# Altium schematic sheet Project_Overview.SchDoc: Project Overview
size A4; Date: Not used; ApprovedBy: Not used; CheckedBy: Not used; Author: Not used; CompanyName: STMicroelectronics; DrawnBy: Not used; Engineer: Not used; Organization: Not used; Address1: Not used; Address2: Not used; Address3: Not used; Address4: Not used; DocumentNumber: Not used; Revision: Not used; SheetNumber: 1; SheetTotal: 6; CurrentTime: Not used; CurrentDate: Not used; Time: Not used; DocumentFullPathAndName: Not used; DocumentName: Not used; ModifiedDate: Not used; ImagePath: Not used; ProjectName: Not used; Application_BuildNumber: Not used
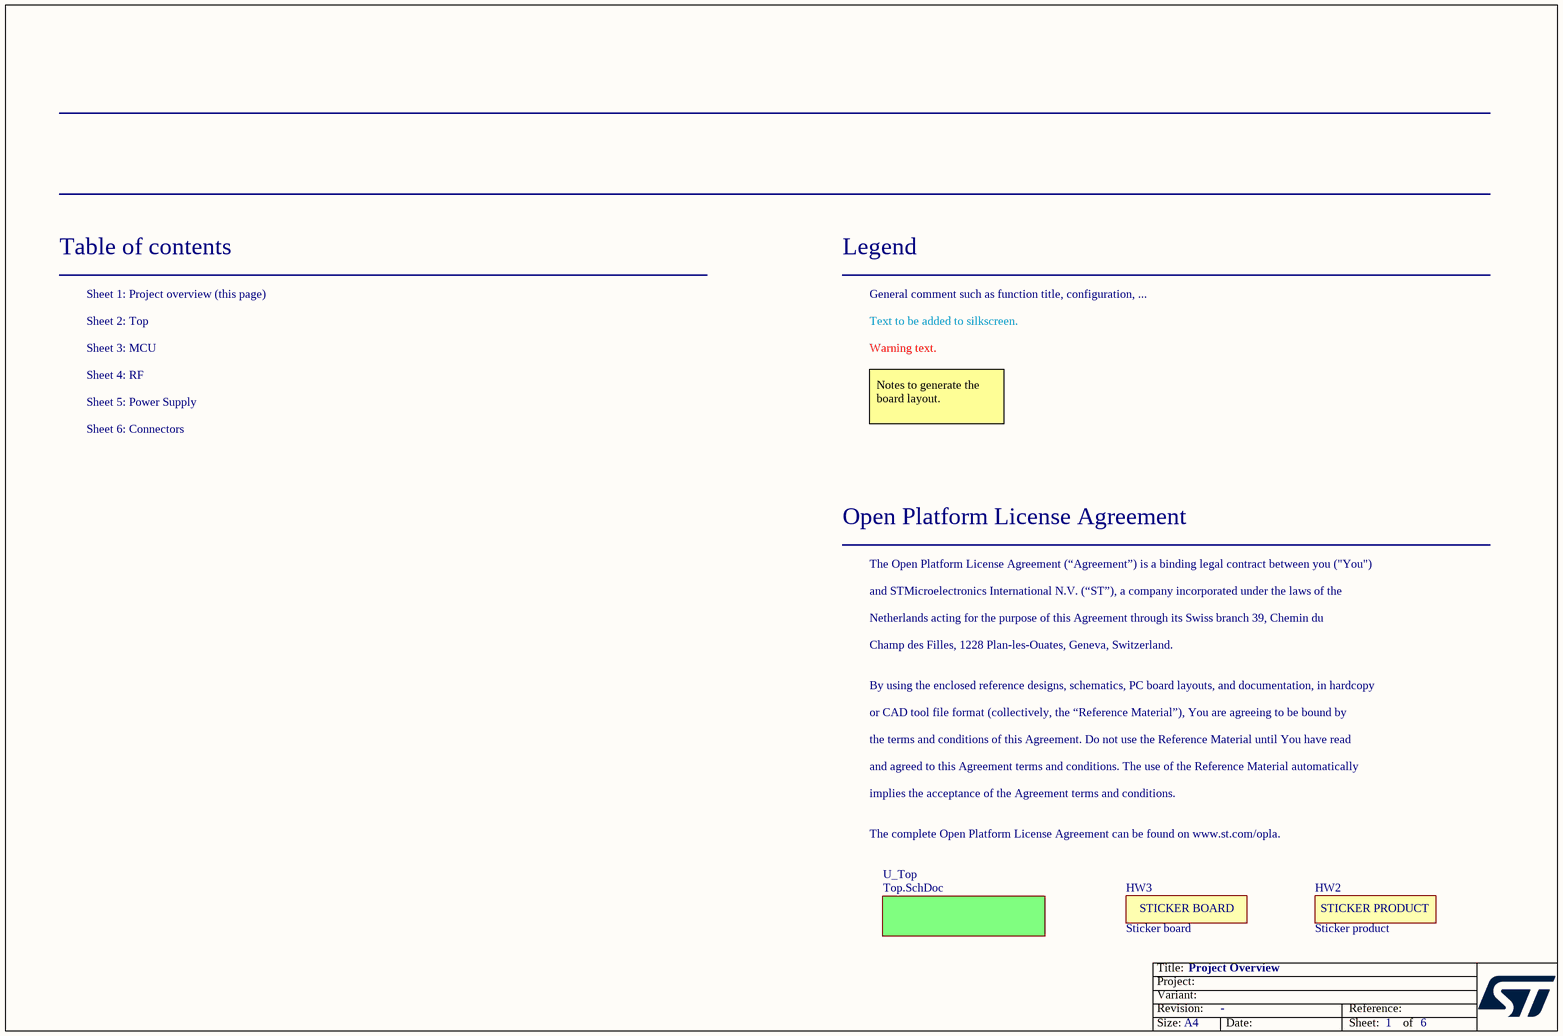
[diagram p0: Project_Overview.SchDoc]

## Parts
HW2  value Sticker product  [STICKER_PRODUCT_25X5]  (hidden comment: STICKER_PRODUCT)  (no BOM)
HW3  value Sticker board  [STICKER_BOARD_25X5]  (hidden comment: STICKER_BOARD)  (no BOM)

## Sub-sheets
U_Top = Top.SchDoc: no entries

## Notes on the sheet
- Table of contents
- Sheet 1: Project overview (this page)
- Legend
- General comment such as function title, configuration, ...
- Sheet 2: Top
- Sheet 3: MCU
- Sheet 4: RF
- Text to be added to silkscreen.
- Warning text.
- Sheet 5: Power Supply
- Sheet 6: Connectors
- Notes to generate the board layout.
- Open Platform License Agreement
- The Open Platform License Agreement (“Agreement”) is a binding legal contract between you ("You")
- and STMicroelectronics International N.V. (“ST”), a company incorporated under the laws of the
- Netherlands acting for the purpose of this Agreement through its Swiss branch 39, Chemin du
- Champ des Filles, 1228 Plan-les-Ouates, Geneva, Switzerland.
- By using the enclosed reference designs, schematics, PC board layouts, and documentation, in hardcopy
- or CAD tool file format (collectively, the “Reference Material”), You are agreeing to be bound by
- the terms and conditions of this Agreement. Do not use the Reference Material until You have read
- and agreed to this Agreement terms and conditions. The use of the Reference Material automatically
- implies the acceptance of the Agreement terms and conditions.
- The complete Open Platform License Agreement can be found on www.st.com/opla.
- Title:
- Project:
- Size:
- Revision:
- Variant:
- A4
- -
- Date:
- Reference:
- Sheet:
- of
- (in symbol MCD-02189) STICKER PRODUCT
- (in symbol MCD-02190) STICKER BOARD

## Library data of the parts
HW2 = MCD-02189: Sticker product 25x5 mm; Part_Type: Misc; Part_Preference: Recommended; ID: 4289; ShowFields: YES; Internal_Part_Number: MCD-02189; Status: Released; Manufacturer: N/A; Manufacturer_Part_Number: N/A; Alternate_Manufacturer: N/A; Alternate_Manufacturer_Part_Number: N/A; ComponentLink1URL: N/A; Order_Code_Digikey: N/A; Order_Code_Farnell: N/A; Order_Code_RS: N/A
HW3 = MCD-02190: Sticker board 25x5 mm; Part_Type: Misc; Part_Preference: Recommended; ID: 4290; ShowFields: YES; Internal_Part_Number: MCD-02190; Status: Released; Manufacturer: N/A; Manufacturer_Part_Number: N/A; Alternate_Manufacturer: N/A; Alternate_Manufacturer_Part_Number: N/A; ComponentLink1URL: N/A; Order_Code_Digikey: N/A; Order_Code_Farnell: N/A; Order_Code_RS: N/A